# EAGLE design EnvFollower (EAGLE 7.7.0)
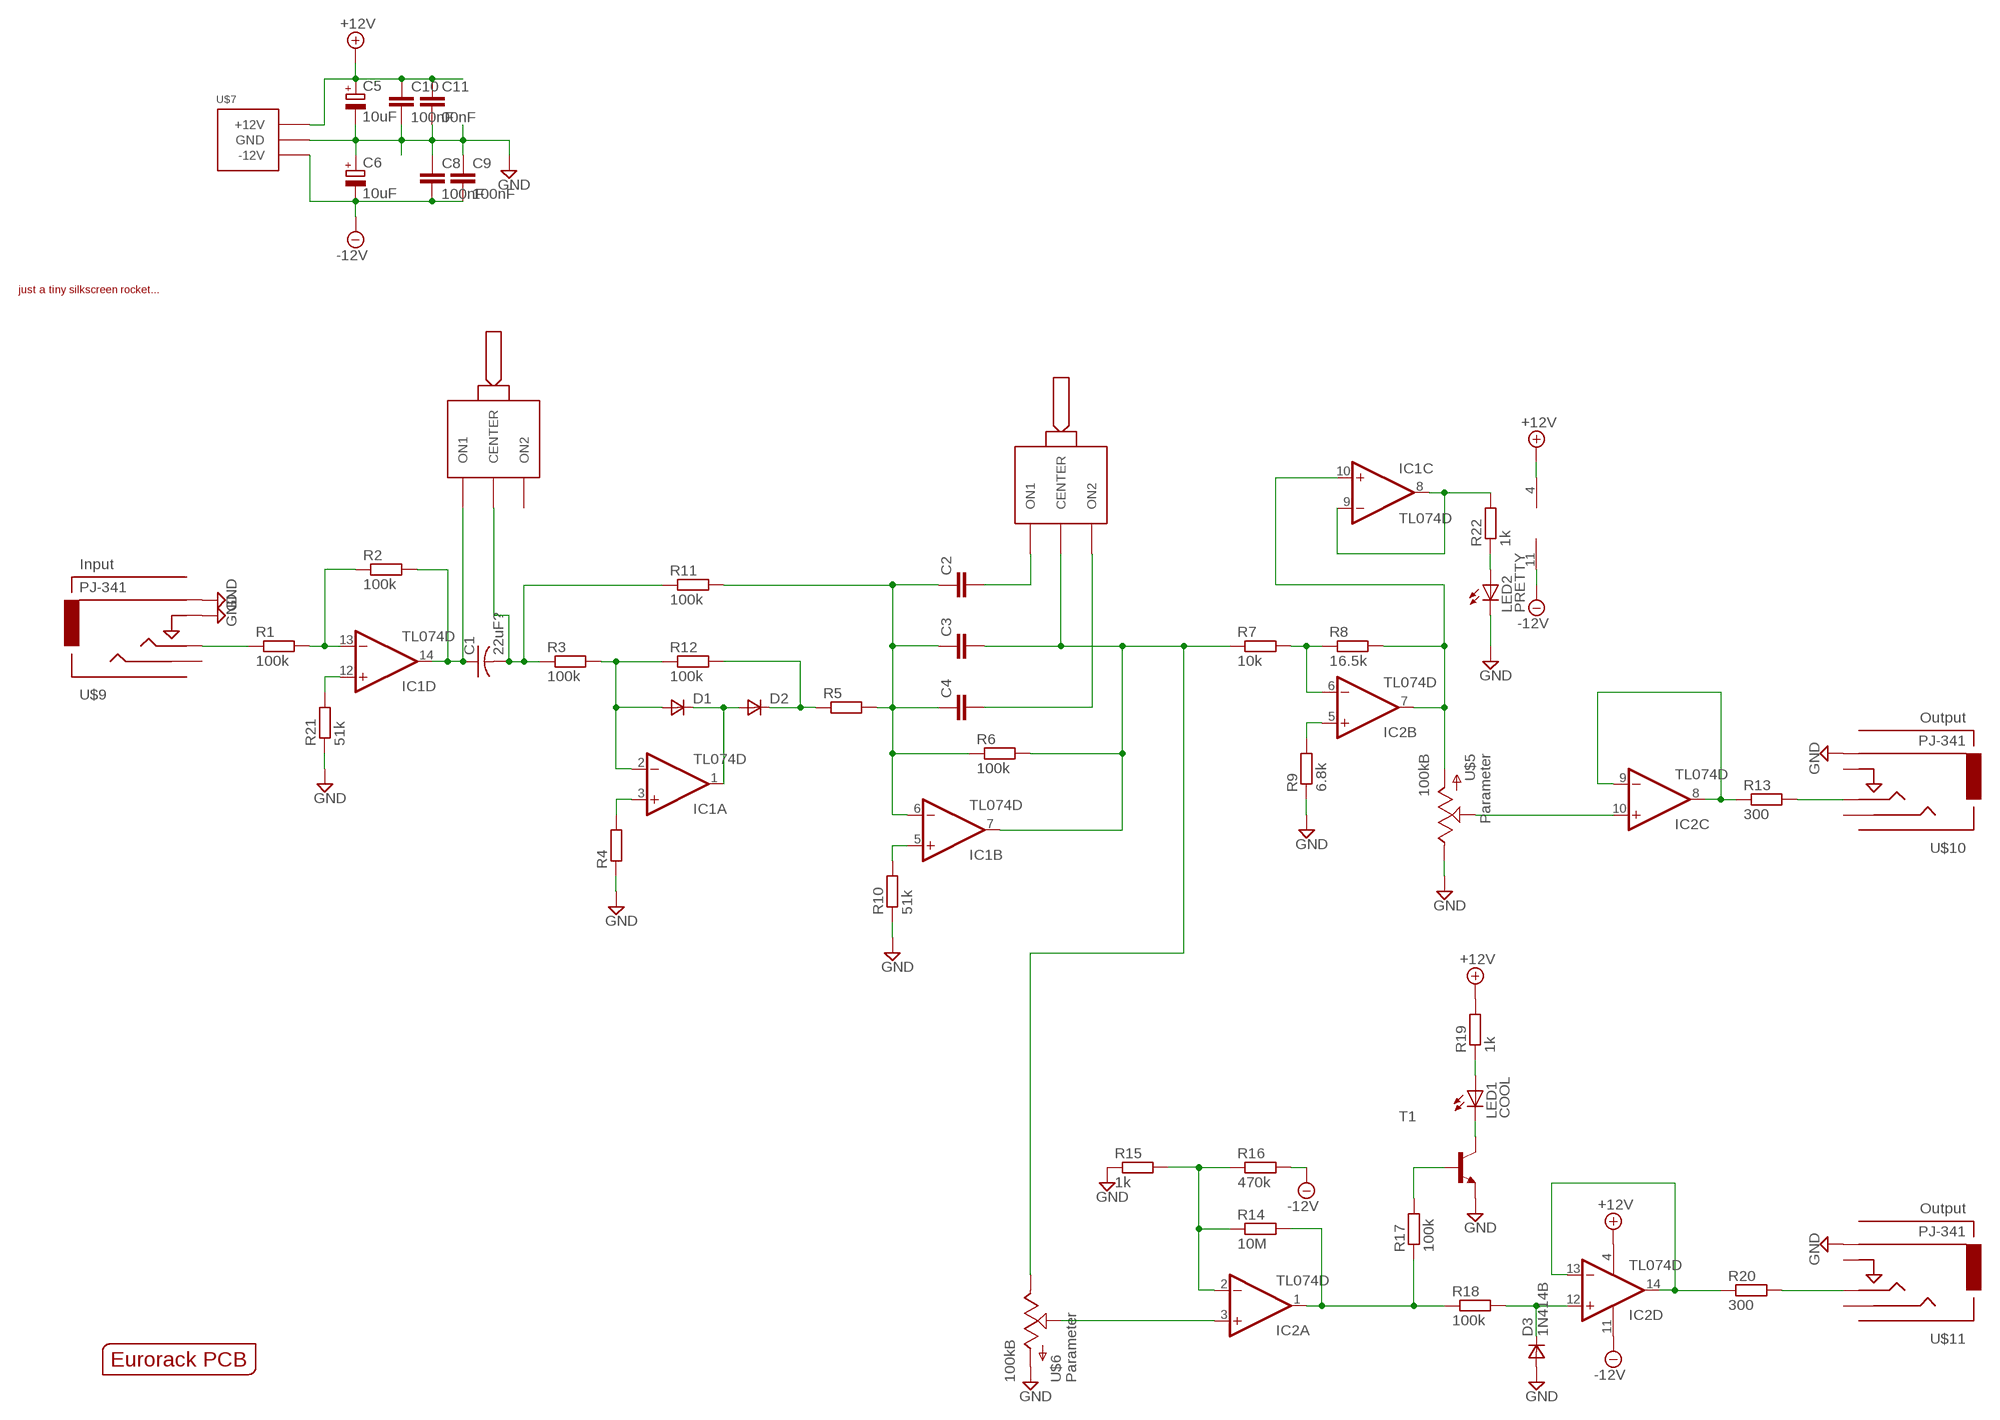
[diagram p0: schematic, sheet 1]

## Parts
C1  22uF?  C-USC1210K  [C1210K]
C2  C-EUC0603K  [C0603K]
C3  C-EUC0603K  [C0603K]
C4  C-EUC0603K  [C0603K]
C5  10uF  CPOL-EU153CLV-0505  [153CLV-0505]
C6  10uF  CPOL-EU153CLV-0505  [153CLV-0505]
C8  100nF  C-EUC0603K  [C0603K]
C9  100nF  C-EUC0603K  [C0603K]
C10  100nF  C-EUC0603K  [C0603K]
C11  00nF  C-EUC0603K  [C0603K]
D1  DSOT23  [SOT-23]
D2  DSOT23  [SOT-23]
D3  1N414B  DSOT23  [SOT-23]
IC1  TL074D  [SO14]
IC2  TL074D  [SO14]
LED1  COOL  LED3MM  [LED3MM]
LED2  PRETTY  LED3MM  [LED3MM]
R1  100k  R-EU_R0603  [R0603]
R2  100k  R-EU_R0603  [R0603]
R3  100k  R-EU_R0603  [R0603]
R4  R-EU_R0603  [R0603]
R5  R-EU_R0603  [R0603]
R6  100k  R-EU_R0603  [R0603]
R7  10k  R-EU_R0603  [R0603]
R8  16.5k  R-EU_R0603  [R0603]
R9  6.8k  R-EU_R0603  [R0603]
R10  51k  R-EU_R0603  [R0603]
R11  100k  R-EU_R0603  [R0603]
R12  100k  R-EU_R0603  [R0603]
R13  300  R-EU_R0603  [R0603]
R14  10M  R-EU_R0603  [R0603]
R15  1k  R-EU_R0603  [R0603]
R16  470k  R-EU_R0603  [R0603]
R17  100k  R-EU_R0603  [R0603]
R18  100k  R-EU_R0603  [R0603]
R19  1k  R-EU_R0603  [R0603]
R20  300  R-EU_R0603  [R0603]
R21  51k  R-EU_R0603  [R0603]
R22  1k  R-EU_R0603  [R0603]
T1  BCX70-NPN-SOT23-BEC  [SOT23-BEC]
U$1  EURORACK_PCB4HP  [EURORACK4HPPCB]
U$2  JUSTATINYROCKET  [JUSTATINYROCKET]
U$4  ONOFFON  [MULTICOMP1MS-ONOFFON]
U$5  100kB  POTZEPHPOT  [OG-POTS_ALPS_POT_VERTICAL]
U$6  100kB  POTZEPHPOT  [OG-POTS_ALPS_POT_VERTICAL]
U$7  POWER_SIMPLE10-OTHERSIDE  [POWER_10_LABELSOTHERSIDE]
U$8  ONOFFON  [MULTICOMP1MS-ONOFFON]
U$9  PJ-341  AUDIO-JACKINPUT  [3.5MM-JACK-SWITCH-13MM-INPUT]
U$10  PJ-341  AUDIO-JACKOUTPUT  [3.5MM-JACK-SWITCH-13MM-OUTPUT]
U$11  PJ-341  AUDIO-JACKOUTPUT  [3.5MM-JACK-SWITCH-13MM-OUTPUT]

## Nets
+12V [power]: C5.+ C10.1 C11.1 IC1.4(P:V+) IC2.4(P:V+) R19.2 U$7.9(+12V) U$7.10(+12V)
-12V [power]: C6.- C8.2 C9.2 IC1.11(P:V-) IC2.11(P:V-) R16.2 U$7.1(-12V) U$7.2(-12V)
GND [power]: C5.- C6.+ C8.1 C9.1 C10.2 C11.2 D3.3(A) LED2.K(C) R4.1 R9.1 R10.1 R15.1 R21.1 T1.E U$5.P$1(E) U$6.P$3(A) U$7.3(GND) U$7.4(GND) U$7.5(GND) U$7.6(GND) U$7.7(GND) U$7.8(GND) U$9.RING@3(RING) U$9.SWITCH@3(SWITCH) U$10.RING@3(RING) U$11.RING@3(RING)
N$1: IC1.8(C:OUT) IC1.9(C:-IN) R22.2
N$2: D2.1(C) R5.1 R12.2
N$3: C2.1 C3.1 C4.1 IC1.6(B:-IN) R5.2 R6.1 R11.2
N$4: R1.1 U$9.TIP@3(TIP)
N$5: IC1.13(D:-IN) R1.2 R2.1
N$6: C1.2 R3.1 R11.1 U$4.2(CENTER)
N$7: C1.1 IC1.14(D:OUT) R2.2 U$4.1(ON1)
N$8 [power]: LED2.A R22.1
N$9: D1.3(A) IC1.2(A:-IN) R3.2 R12.1
N$10: D1.1(C) D2.3(A) IC1.1(A:OUT)
N$11: IC1.3(A:+IN) R4.2
N$12: IC1.12(D:+IN) R21.2
N$15: C3.2 IC1.7(B:OUT) R6.2 R7.1 U$6.P$1(E) U$8.2(CENTER)
N$16: C2.2 U$8.1(ON1)
N$17: C4.2 U$8.3(ON2)
N$20: IC1.5(B:+IN) R10.2
N$22: IC2.6(B:-IN) R7.2 R8.1
N$23: IC2.5(B:+IN) R9.2
N$24: IC1.10(C:+IN) IC2.7(B:OUT) R8.2 U$5.P$3(A)
N$25: IC2.10(C:+IN) U$5.P$2(S)
N$26: IC2.8(C:OUT) IC2.9(C:-IN) R13.1
N$27: R13.2 U$10.TIP@3(TIP)
N$28: IC2.2(A:-IN) R14.1 R15.2 R16.1
N$29: IC2.1(A:OUT) R14.2 R17.1 R18.1
N$30: R17.2 T1.B
N$31: LED1.K(C) T1.C
N$32: LED1.A R19.1
N$33: D3.1(C) IC2.12(D:+IN) R18.2
N$34: IC2.13(D:-IN) IC2.14(D:OUT) R20.1
N$35: R20.2 U$11.TIP@3(TIP)
N$36: IC2.3(A:+IN) U$6.P$2(S)
Unconnected: U$4.3(ON2) U$9.SECOND@3(SECOND) U$10.SECOND@3(SECOND) U$10.SWITCH@3(SWITCH) U$11.SECOND@3(SECOND) U$11.SWITCH@3(SWITCH)

## Library data of the parts
C1 = adafruit:C-US: CAPACITOR, American symbol
C2-C4 C8-C11 = resistor:C-EU: CAPACITOR, European symbol
C5 C6 = resistor:CPOL-EU: POLARIZED CAPACITOR, European symbol
D1-D3 = zetex:D: DIODE; MPN: CDSOT23-T03; OC_FARNELL: 1824866; OC_NEWARK: 75K7096
IC1 IC2 = EurorackModularParts:TL074: OP AMP
LED1 LED2 = led:LED: LED OSRAM: - CHIPLED LG R971, LG N971, LY N971, LG Q971, LY Q971, LO R971, LY R971 LH N974, LH R974 LS Q976, LO Q976, LY Q976 LO Q996 - Hyper CHIPLED LW Q18S LB Q993, LB Q99A, LB R99A - SideLED LS A670, LO A670, LY A670, LG A670, LP A670 LB A673, LV A673, LT A673, LW A673 LH A674 LY A675 LS A676, LA A676, LO A676, LY A676, LW A676 LS A679, LY A679, LG A679 - Hyper Micro SIDELED® LS Y876, LA Y876, LO Y876, LY Y876 LT Y87S - SmartLED LW L88C, LW L88S LB L89C, LB L89S, LG L890 LS L89K, LO L89K, LY L89K LS L896, LA L896, LO L896, LY L896 - TOPLED LS T670, LO T670, LY T670, LG T670, LP T670 LSG T670, LSP T670, LSY T670, LOP T670, LYG T670 LG T671, LOG T671, LSG T671 LB T673, LV T673, LT T673, LW T673 LH T674 LS T676, LA T676, LO T676, LY T676, LB T676, LH T676, LSB T676, LW T676 LB T67C, LV T67C, LT T67C, LS T67K, LO T67K, LY T67K, LW E67C LS E67B, LA E67B, LO E67B, LY E67B, LB E67C, LV E67C, LT E67C LW T67C LS T679, LY T679, LG T679 LS T770, LO T770, LY T770, LG T770, LP T770 LB T773, LV T773, LT T773, LW T773 LH T774 LS E675, LA E675, LY E675, LS T675 LS T776, LA T776, LO T776, LY T776, LB T776 LHGB T686 LT T68C, LB T68C - Hyper Mini TOPLED® LB M676 - Mini TOPLED Santana® LG M470 LS M47K, LO M47K, LY M47K Source: http://www.osram.convergy.de LUXEON: - LUMILED® LXK2-PW12-R00, LXK2-PW12-S00, LXK2-PW14-U00, LXK2-PW14-V00 LXK2-PM12-R00, LXK2-PM12-S00, LXK2-PM14-U00 LXK2-PE12-Q00, LXK2-PE12-R00, LXK2-PE12-S00, LXK2-PE14-T00, LXK2-PE14-U00 LXK2-PB12-K00, LXK2-PB12-L00, LXK2-PB12-M00, LXK2-PB14-N00, LXK2-PB14-P00, LXK2-PB14-Q00 LXK2-PR12-L00, LXK2-PR12-M00, LXK2-PR14-Q00, LXK2-PR14-R00 LXK2-PD12-Q00, LXK2-PD12-R00, LXK2-PD12-S00 LXK2-PH12-R00, LXK2-PH12-S00 LXK2-PL12-P00, LXK2-PL12-Q00, LXK2-PL12-R00 Source: www.luxeon.com KINGBRIGHT: KA-3528ASYC Source: www.kingbright.com
R1-R22 = resistor:R-EU_: RESISTOR, European symbol
T1 = transistor:*-NPN-: NPN Transistror BF959 corrected 2008.03.06
U$1 = EurorackModularParts:EURORACK_PCB
U$2 = zephod-components:JUSTATINYROCKET
U$4 U$8 = EurorackModularParts:ONOFFON
U$5 U$6 = EurorackModularParts:POT; DESC: Parameter
U$7 = EurorackModularParts:POWER_SIMPLE
U$9 = EurorackModularParts:AUDIO-JACK: Switching Mono 3.5mm Audio Jack from Erthenvar.; DESC: Input; MPN: PJ-341
U$10 U$11 = EurorackModularParts:AUDIO-JACK: Switching Mono 3.5mm Audio Jack from Erthenvar.; DESC: Output; MPN: PJ-341

## Net classes
0 default: width 0.203 mm
1 power: width 0.381 mm

## Board
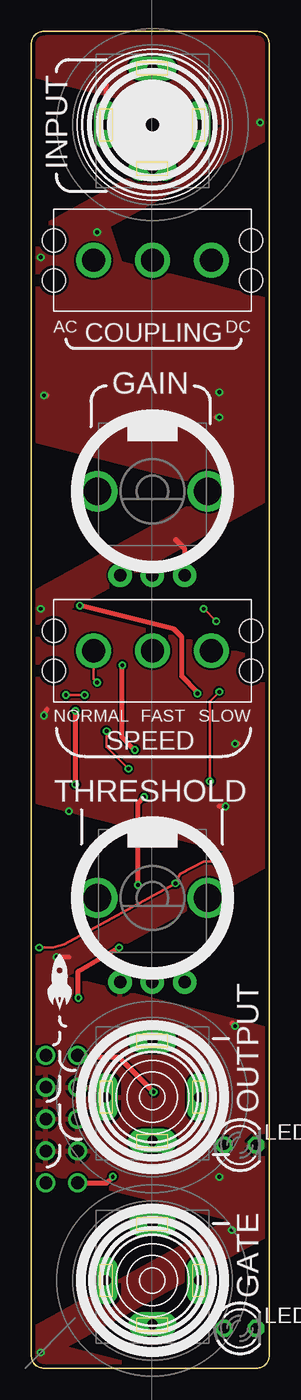
[diagram p1: board, top side]
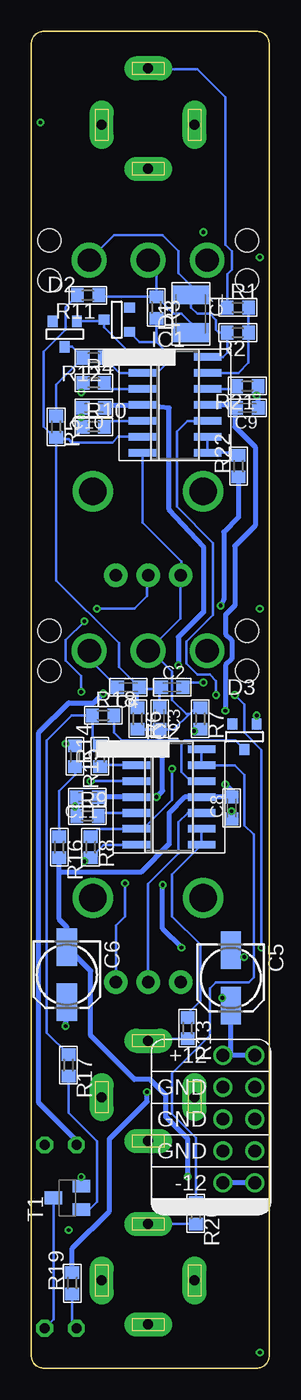
[diagram p2: board, bottom side, seen from below]

Size 18.98 x 106.5 mm. Coordinates in mm from the lower left corner, seen from the top.
Copper layers (1*16): Top 0.035mm / dielectric 1.5mm / Bottom 0.035mm
Design rules "ITEADstudio_DRC": minimum track width 6mil, minimum drill 12mil, track to track 6mil, track to pad 6mil, pad to pad 6mil, via to via 6mil, smd to smd 0mil, copper to edge 10mil, drill to drill 10mil, minimum pad ring 10mil, minimum via ring 6mil, stop-mask expansion 2mil, vias tented up to drill 100mil, thermal gap 10mil

### Footprints (pad centres in the part's own frame; a part is rotated, then mirrored left to right if it is on the bottom)
C1210K = smd 1.5 x 2.9: 1 -1.5,0; 2 1.5,0
C0603K = smd 1.05 x 1.08: 1 -0.875,0; 2 0.875,0
153CLV-0505 = smd 3 x 1.6: + 2.2,0; - -2.2,0
SOT-23 = smd 0.787 x 0.889: 1 0.025,-1.016; 2 -0.94,1.016; 3 0.991,1.016
SO14 = smd 0.6 x 2.2: 1 -3.81,-2.6; 2 -2.54,-2.6; 3 -1.27,-2.6; 4 0,-2.6; 5 1.27,-2.6; 6 2.54,-2.6; 7 3.81,-2.6; 8 3.81,2.6; 9 2.54,2.6; 10 1.27,2.6; 11 0,2.6; 12 -1.27,2.6; 13 -2.54,2.6; 14 -3.81,2.6
LED3MM = drill 0.813 octagon: A -1.27,0; K 1.27,0
R0603 = smd 1 x 1.1: 1 -0.85,0; 2 0.85,0
SOT23-BEC = smd 1 x 1.4: B -0.95,-1.1; C 0,1.1; E 0.95,-1.1
MULTICOMP1MS-ONOFFON = drill 1.85: 1 -4.7,0; 2 0,0; 3 4.7,0 | hole 1.85: -7.875,1.59; -7.875,-1.59; 7.875,1.59; 7.875,-1.59
OG-POTS_ALPS_POT_VERTICAL = drill 1 pad 1.88: P$1 -2.58,-6.7; P$2 0,-6.7; P$3 2.58,-6.7 | drill 2.2 pad 3.175: P$4 4.4,0; P$5 -4.4,0
POWER_10_LABELSOTHERSIDE = drill 1.016: 1 -5.08,-1.27; 2 -5.08,1.27; 3 -2.54,-1.27; 4 -2.54,1.27; 5 0,-1.27; 6 0,1.27; 7 2.54,-1.27; 8 2.54,1.27; 9 5.08,-1.27; 10 5.08,1.27
3.5MM-JACK-SWITCH-13MM-INPUT = drill 0.8 pad 1.93 long: RING@3 -3.7,0; SECOND@3 0,-3.5; SWITCH@3 3.7,0; TIP@3 0,4.5
3.5MM-JACK-SWITCH-13MM-OUTPUT = drill 0.8 pad 1.93 long: RING@3 -3.7,0; SECOND@3 0,-3.5; SWITCH@3 3.7,0; TIP@3 0,4.5

### Placement (x,y rotation side)
C1  6.25,84 270 bottom
C2  7.75,54.25 0 bottom
C3  8.75,51.75 270 bottom
C4  11.25,54.25 180 bottom
C5  3.08,31.09 270 bottom
C6  16.14,31.34 270 bottom
C8  3,44.62 90 bottom
C9  1.75,76.5 180 bottom
C10  14,76.5 180 bottom
C11  14.5,45.5 180 bottom
D1  12.16,83.55 270 bottom
D2  16.34,82.38 0 bottom
D3  2,50.3 0 bottom
IC1  7.53,76.74 270 bottom
IC2  8,45.5 270 bottom
LED1  16.64,3.17 0 top
LED2  16.64,17.78 0 top
R1  2.5,84.5 0 bottom
R2  2.5,82.5 180 bottom
R3  9,84.5 270 bottom
R4  14,78.5 0 bottom
R5  17,75 270 bottom
R6  10.5,51.75 270 bottom
R7  5.5,51.75 270 bottom
R8  14.25,41.5 270 bottom
R9  14.5,44 0 bottom
R10  14,75 0 bottom
R11  14.46,85.48 180 bottom
R12  14,80.5 180 bottom
R13  6.51,27.09 270 bottom
R14  13.5,48.75 90 bottom
R15  15.5,48.75 270 bottom
R16  16.75,41.5 270 bottom
R17  16.01,24.13 270 bottom
R18  13.25,52 0 bottom
R19  15.72,6.76 90 bottom
R20  5.86,12.34 270 bottom
R21  1.75,78.25 180 bottom
R22  2.46,71.87 90 bottom
T1  16.11,13.57 90 bottom
U$1  -0.5,0 0 top
U$2  2.25,30.75 0 top
U$4  9.66,88.27 180 top
U$5  9.66,37.47 0 top
U$6  9.66,69.85 0 top
U$7  2.42,19.84 90 bottom
U$8  9.66,57.15 0 top
U$9  9.66,99.06 0 top
U$10  9.66,21.59 0 top
U$11  9.66,6.99 0 top

### Tracks (layer width: path | path; a pad name or v marks a point on that pad's centre or on a via)
+12V  (via drill 0.3)
  Top 0.381: v9.75,22 7,24.75 4.12,24.75 U$7.10 | v3.75,29.5 3.75,31.62 v7,33.5 | v8.5,38.5 8.5,45 v9,45.5 | v8.25,49.25 7.23,50.27 7.23,55.98 v7.25,56
  Bottom 0.381: U$7.9 U$7.10 3.08,24.92 C5.+ 3.14,28.89 v3.75,29.5 | C11.1 IC2.4 v9,45.5 8.5,46 8.5,49 v8.25,49.25 | C10.1 12.88,76.74 IC1.4 9.99,76.63 9.37,76.63 7.98,76.5 7.98,68.41 5.22,65.4 5.22,60.28 7.25,58.25 v7.25,56 | R19.2 15.72,9.53 12.75,12.5 12.75,18.25 9.75,21.25 v9.75,22 | v7,33.5 8.5,35 v8.5,38.5
-12V  (via drill 0.3)
  Top 0.381: U$7.2 6.01,14.76 v6.5,15.25 | v3.5,52.38 v3.5,46.5
  Bottom 0.381: U$7.1 U$7.2 | IC1.11 2.69,76.74 C9.2 2.75,76.38 2.75,75 1.12,73.38 1.12,67.12 2.75,65.5 2.75,60.75 3.5,60 3.5,58.5 3,58 3,56.5 3.5,56 v3.5,52.38 | 16.75,39.5 16.75,35.75 16.14,35.15 C6.- 14.25,31.65 14.25,26.5 10.75,23 9.5,23 8.25,21.75 8.25,20 6.5,18.25 v6.5,15.25 | 16.75,39.5 R16.2 | 16.75,39.5 10.25,39.5 8,41.75 8,44.25 6.75,45.5 IC2.11 C8.2 2.88,45.88 v3.5,46.5
GND  (via drill 0.3)
  Top 0.381: v15,15.23 15,15.1 | v2,32.75 3,32.75 | v16.25,27.25 16,27.5 | v3,44.38 3,44.5 | v1,52 1.25,52.5 | v16.25,49.75 16.5,49.75 | v15.5,44.75 15,44.75 | v15,75.75 14.75,75.75 | v1,77.5 1.25,77.5 | U$6.P$3 12.24,65.26 11.5,66 | U$9.RING@3 5.96,102.21 6,102.25
  Bottom 0.381: T1.E v15.01,15.22 v15,15.23 | C5.- 3.08,32.83 v2,32.75 | C6.+ 16.25,27.5 v16.25,27.25 | C8.1 v3,44.38 | D3.3 0.99,51.51 v1,52 | R15.1 v16.25,49.75 | C11.2 15.38,44.88 v15.5,44.75 15.35,44.6 R9.1 | R10.1 15,75.15 v15,75.75 15,76.38 C10.2 | R4.1 14.75,78.4 v15,77.75 | R21.1 0.9,77.6 v1,77.5 0.88,77.38 C9.1
  other vias: 0.75,1.25 16,11 0.75,60.5 0.75,88.5 18.25,99.25 5.25,90.5
  pour Top: 19.75,26.75 -1,32 -1.25,16.25 19.5,11
  pour Top: 20,56 -0.75,61.25 -1,45.5 19.75,40.25
  pour Top: 20,84.75 -0.75,90 -1,74.25 19.75,69
  pour Top: 20.25,113.75 -0.5,119 -0.75,103.25 20,98
  pour Top: 19.75,-2.75 -1,2.5 -1.25,-13.25 19.5,-18.5
  pour Top: 19.5,13.75 -1,2.5 -1,-0.25 19.5,11
  pour Top: 19.5,43.25 -1,32 -1,29.25 19.5,40.5
  pour Top: 19.75,72.5 -0.75,61.25 -0.75,58.5 19.75,69.75
  pour Top: 19.75,101.25 -0.75,90 -0.75,87.25 19.75,98.5
  pour Top: 3.25,91 3.25,90.75 6,91.25 7.25,87.5 2.5,86.5 2.5,91
N$1
  Bottom 0.203: IC1.9 IC1.8 2.67,72.93 R22.2
N$2
  Bottom 0.203: R5.1 17,78.35 R12.2 15.71,81.36 D2.1
N$3
  Bottom 0.203: R5.2 17.15,74.15 18,75 18,81 16.25,82.75 16.25,84.54 R11.2 | IC1.6 12.05,74.2 12.5,73.75 15.75,73.75 16,74 16.85,74 R5.2 | C3.1 8.75,54.12 | 8.75,54.12 C2.1 | R6.1 10.5,54.12 C4.1 | 8.75,54.12 10.25,54.12 C4.1 | C4.1 12,55.88 12,57.75 17,62.75 R5.2
N$4
  Bottom 0.203: U$9.TIP@3 9.6,103.5 5.75,103.5 3.5,101.25 3.5,89.5 3,89 3,87.5 3.35,87.15 R1.1
N$5
  Bottom 0.203: IC1.13 2.47,79.28 1.65,80.1 R2.1 R1.2
N$6
  Bottom 0.203: 8.97,85.38 R3.1 | R3.1 13.48,85.35 R11.1 | R3.1 9,87.61 U$4.2 | C1.2 6.25,83.25 7,84 7.65,84 R3.1
N$7
  Bottom 0.203: U$4.1 12.38,90.25 8.5,90.25 7.25,89 7.25,87.25 6.25,86.25 C1.1 6.25,84.5 5.75,84 4.75,84 4.25,83.5 4.25,82.75 4,82.5 R2.2 3.35,80.9 3.7,80.55 IC1.14
N$8  (via drill 0.3)
  Top 0.381: v13.25,53.75 13.25,53.88 12,55.12 12,58.25 11.38,58.88 v3.88,60.75
  Bottom 0.381: R22.1 2.46,67.79 3.62,66.62 3.62,61.25 v3.88,60.75 | LED2.A 15.38,18.12 18.38,21.12 18.38,50.62 16,53 14,53 v13.25,53.75
N$9
  Bottom 0.203: R12.1 11.93,79.28 IC1.2 8.97,79.28 8.25,80 8.25,81 9,81.75 | 9,81.75 R3.2 | 9,81.75 10.34,81.75 D1.3
N$10
  Bottom 0.203: D2.3 13.31,83.4 D1.1 13.18,82.93 10.75,80.5 10.18,80.5 IC1.1
N$11
  Bottom 0.203: R4.2 12.66,78.01 IC1.3
N$12
  Bottom 0.203: R21.2 2.96,78.01 IC1.12
N$15
  Bottom 0.203: IC1.7 10.12,67.38 7,64.25 7,63.23 U$6.P$1 7.08,59.73 U$8.2 9.4,57.15 7.75,55.5 7.75,53.25 6.62,52.12 6.38,52.12 | R7.1 5.9,52.6 6.38,52.12 | 6.38,52.12 7.62,50.88 C3.2 10.47,50.88 R6.2
N$16  (via drill 0.3)
  Top 0.203: U$8.1 4.96,54.91 v5.25,54.62
  Bottom 0.203: v5.25,54.62 6.5,54.62 C2.2
N$17
  Bottom 0.203: C4.2 14.36,56.48 U$8.3
N$20
  Bottom 0.203: IC1.5 12.68,75.47 R10.2
N$22  (via drill 0.3)
  Top 0.203: v7.75,47.75 6,49.5 v6,50.75
  Bottom 0.203: R8.1 13.64,42.96 IC2.6 10.52,43.03 9.99,43.03 7.75,45.27 v7.75,47.75 | R7.2 5.65,50.75 v6,50.75
N$23
  Bottom 0.203: IC2.5 13.42,44.23 R9.2
N$24  (via drill 0.3)
  Top 0.203: v0.62,33.5 1.75,33.5 2.62,33.75 v11.5,38.62 11.88,39.38 13.75,40.38 v14.75,40.38 | v2.75,53.62 v4.25,53.62
  Bottom 0.203: IC2.7 13.21,41.69 R8.2 v14.75,40.38 | U$5.P$3 12.24,35.26 11.5,36 v11.5,38.62 | IC1.10 6.53,75.47 7.38,74.62 7.38,68.62 4.5,65.75 4.5,60 6.62,57.88 6.62,56.12 5.75,55.25 4.75,55.25 4.25,54.75 v4.25,53.62 | v0.62,33.5 0.62,49.25 2,50.62 2,52.88 v2.75,53.62
N$25
  Bottom 0.203: U$5.P$2 9.66,38.59 7.25,41 7.25,43.5 6.5,44.25 5.42,44.25 IC2.10
N$26
  Bottom 0.203: R13.1 6.51,28.24 5.5,29.25 5.5,33.75 7.75,36 7.75,39.34 IC2.8 IC2.9
N$27
  Bottom 0.203: R13.2 9.51,26.24 U$10.TIP@3
N$28
  Bottom 0.203: IC2.2 13.36,48.04 R14.1 R15.2 15.5,47.25 16.75,46 R16.1
N$29
  Bottom 0.203: IC2.1 13.21,49.31 R14.2 14.1,50.2 R18.1 15.75,52 17.75,50 17.75,26.72 R17.1
N$30
  Bottom 0.203: T1.B 14.36,12.62 13.75,13.23 13.75,18.06 16.01,20.32 R17.2
N$31
  Bottom 0.203: T1.C 17.2,3.88 LED1.K
N$32
  Bottom 0.203: R19.1 15.72,3.52 LED1.A
N$33
  Bottom 0.203: IC2.12 6.27,46.77 7,47.5 7,49.75 | 7,49.75 6.75,50 2.69,50 D3.1 | 7,49.75 7.25,50 11.75,50 12.4,50.65 R18.2
N$34
  Bottom 0.203: R20.1 5.86,18.36 7.75,20.25 7.75,23.5 4.75,26.5 4.75,30.25 4.25,30.75 1.62,30.75 1.25,31.12 1.25,42.5 2,43.25 2,47.25 2.75,48 5.36,48 IC2.13 IC2.14
N$35
  Bottom 0.203: R20.2 U$11.TIP@3
N$36  (via drill 0.3)
  Top 0.203: v14.25,46.75 14.25,53.12 v15,53.88 | v14.75,59.5 v13.75,60.5
  Bottom 0.203: IC2.3 14.23,46.77 v14.25,46.75 | v15,53.88 15,55.12 16.25,56.38 16.25,58 v14.75,59.5 | v13.75,60.5 10.75,60.5 9.75,61.5 9.75,63.06 U$6.P$2

### Text on the board
tPlace: INPUT | AC | DC | COUPLING | GAIN | NORMAL | FAST | SLOW | SPEED | THRESHOLD | OUTPUT | GATE